# EAGLE design micro (EAGLE 9.6.2)
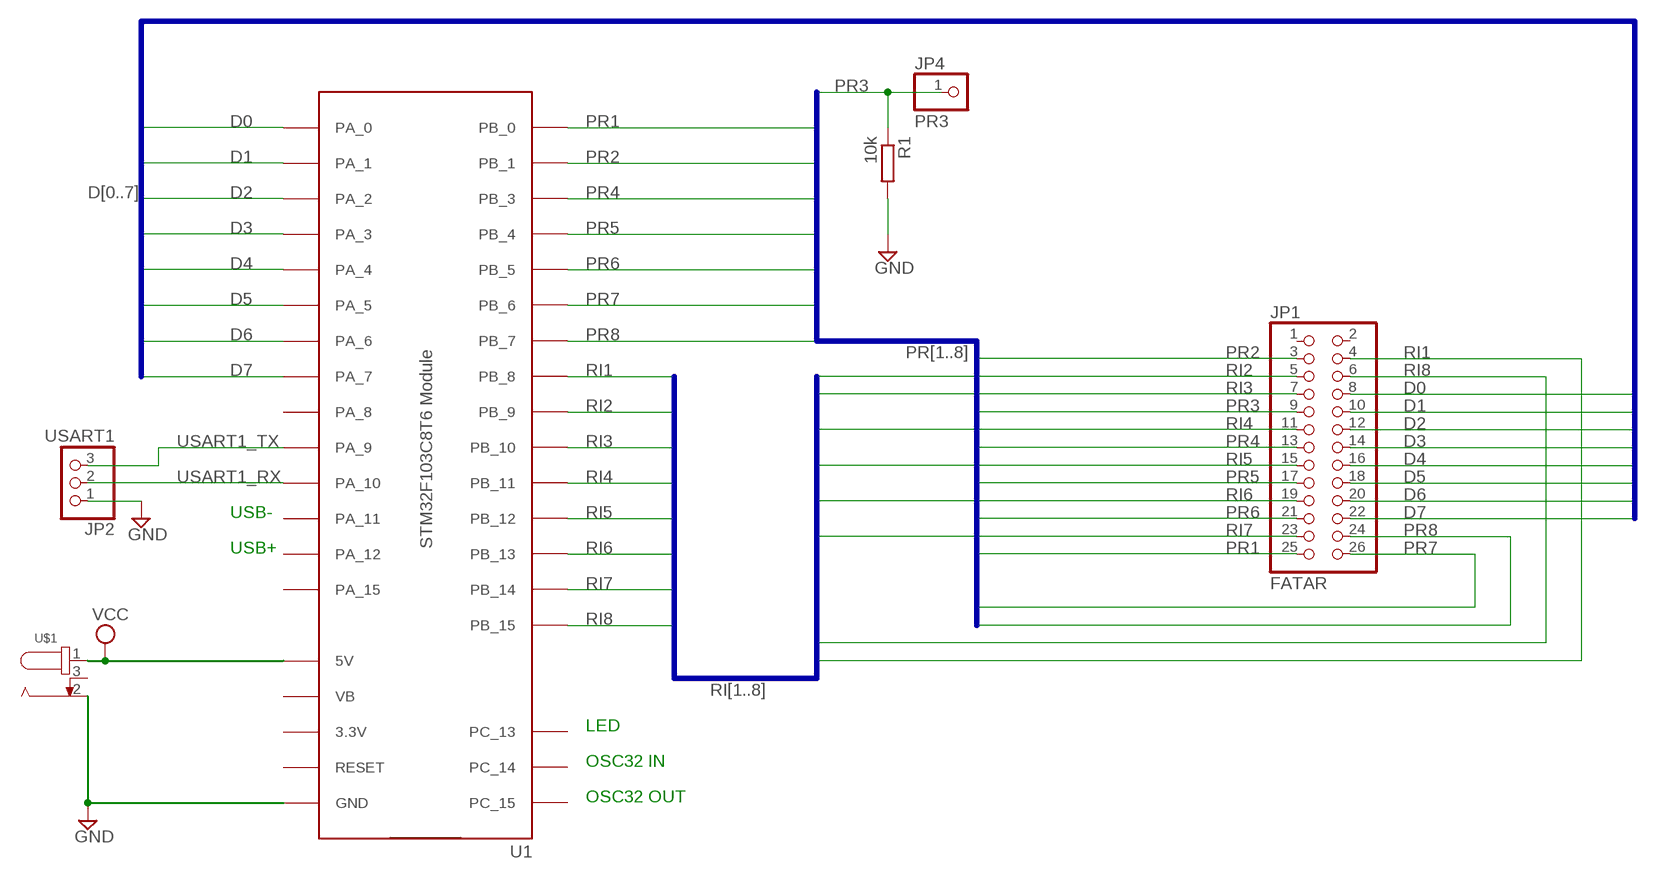
[diagram p0: schematic, sheet 1]

## Parts
JP1  FATAR  PINHD-2X13  [2X13]
JP2  USART1  PINHD-1X3  [1X03]
JP4  PR3  PINHD-1X1  [1X01]
R1  10k  R-EU_0204/7  [0204/7]
U1  STM32F103C8T6-MODULE  [STM32F103C8T6-MODULE]
U$1  694103303002  [694103303002]

## Nets
D0: JP1.8 U1.PA_0
D1: JP1.10 U1.PA_1
D2: JP1.12 U1.PA_2
D3: JP1.14 U1.PA_3
D4: JP1.16 U1.PA_4
D5: JP1.18 U1.PA_5
D6: JP1.20 U1.PA_6
D7: JP1.22 U1.PA_7
GND: JP2.1 R1.2 U1.GND@1(GND) U1.GND@2(GND) U1.GND@3(GND) U$1.2
PR1: JP1.25 U1.PB_0
PR2: JP1.3 U1.PB_1
PR3: JP1.9 JP4.1 R1.1
PR4: JP1.13 U1.PB_3
PR5: JP1.17 U1.PB_4
PR6: JP1.21 U1.PB_5
PR7: JP1.26 U1.PB_6
PR8: JP1.24 U1.PB_7
RI1: JP1.4 U1.PB_8
RI2: JP1.5 U1.PB_9
RI3: JP1.7 U1.PB_10
RI4: JP1.11 U1.PB_11
RI5: JP1.15 U1.PB_12
RI6: JP1.19 U1.PB_13
RI7: JP1.23 U1.PB_14
RI8: JP1.6 U1.PB_15
USART1_RX: JP2.2 U1.PA_10
USART1_TX: JP2.3 U1.PA_9
VCC: U1.5V U$1.1
Unconnected: JP1.1 JP1.2 U1.3.3V@1(3.3V) U1.3.3V@2(3.3V) U1.PA_8 U1.PA_11 U1.PA_12 U1.PA_15 U1.PC_13 U1.PC_14 U1.PC_15 U1.RESET U1.VB U$1.3

## Buses
D[0..7]
PR[1..8]
RI[1..8]

## Notes on the sheet
- USB-
- USB+
- LED
- OSC32 IN
- OSC32 OUT

## Library data of the parts
JP1 = pinhead:PINHD-2X13: PIN HEADER
JP2 = pinhead:PINHD-1X3: PIN HEADER
JP4 = pinhead:PINHD-1X1: PIN HEADER
R1 = rcl:R-EU_: RESISTOR, European symbol; SPICEPREFIX: R
U1 = bluepill_eagle_lib:STM32F103C8T6-MODULE: STM32F103C8T6 module with ARM Cortex-3, 20kB SRAM, 64kB Flash, 72MHz
U$1 = DC Power Jacks:694103303002: CONN PWR JACK 1.05X3.5MM SOLDER Manufacturer's datasheet <https://katalog.we-online.de/em/datasheet/6941xx303002.pdf>; CREATED_BY: PCBLayout.com; DIGIKEY_PART_NUMBER: 732-5925-ND; MANUFACTURER: Wurth Electronics Inc.; MPN: 694103303002

## Board
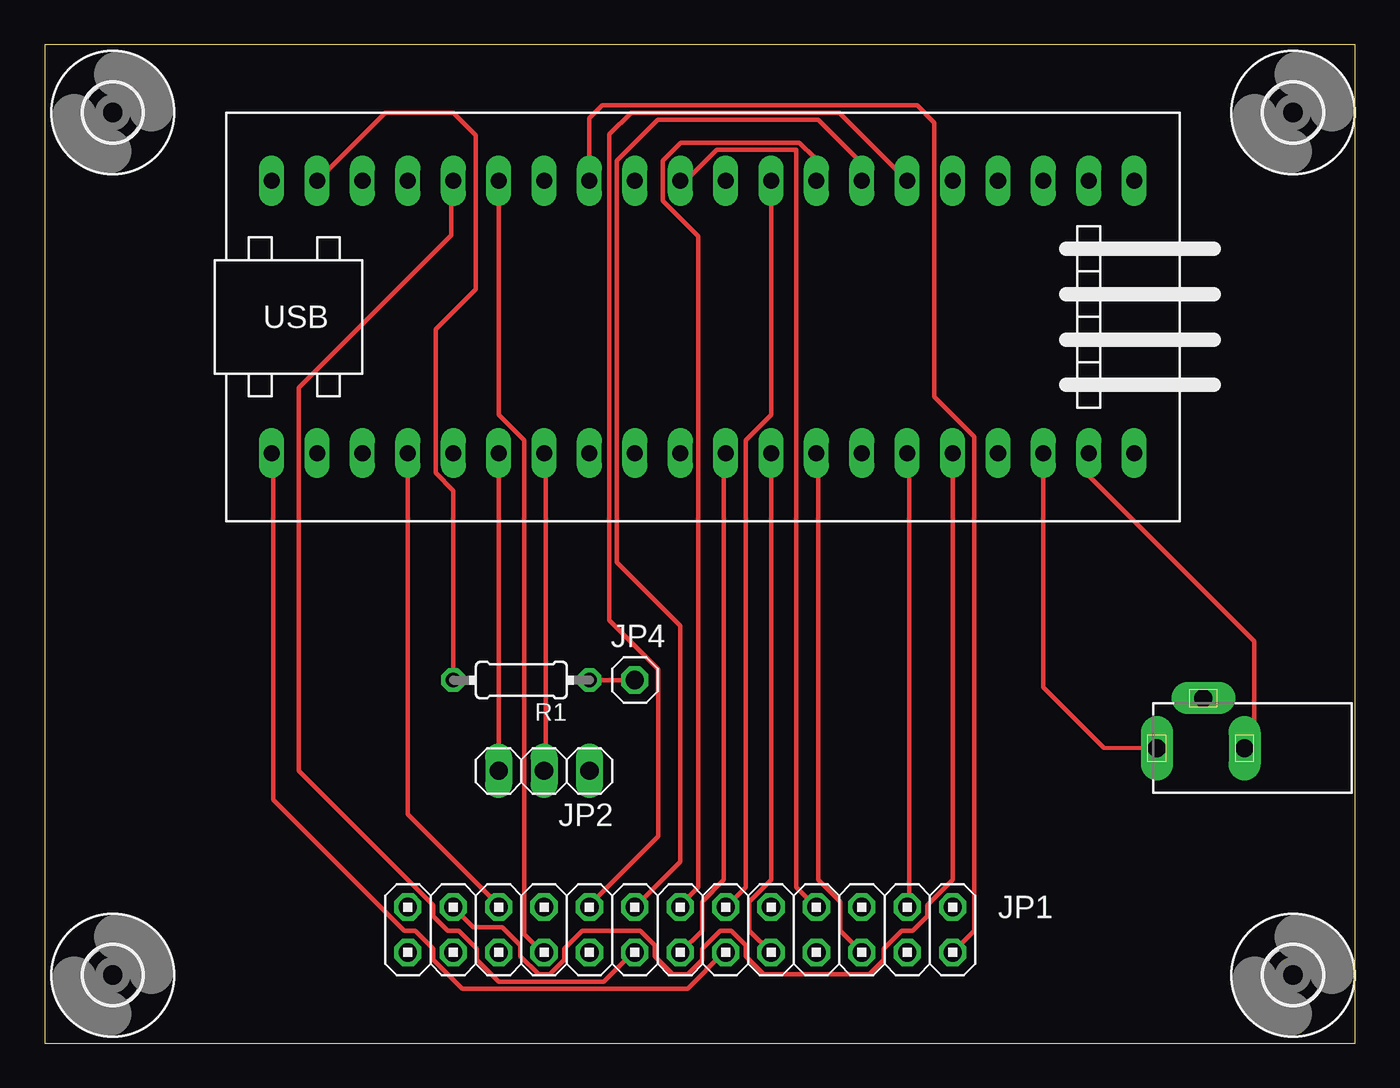
[diagram p1: board, top side]
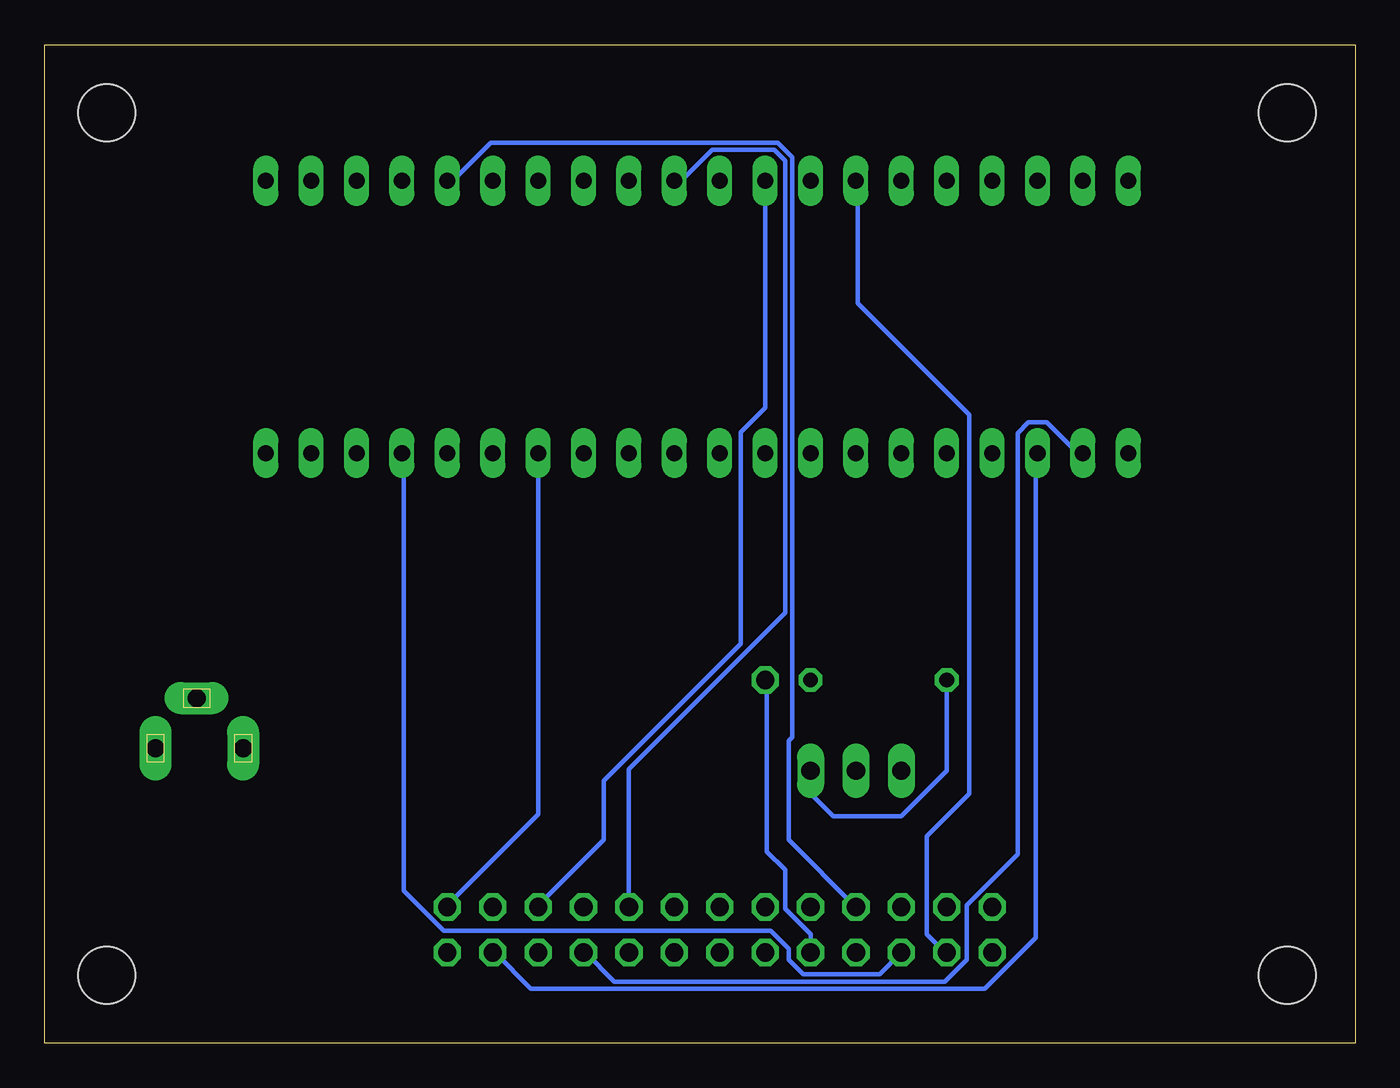
[diagram p2: board, bottom side, seen from below]

Size 73.33 x 55.87 mm. Coordinates in mm from the lower left corner, seen from the top.
Outline: 0,0 73.33,0 73.33,55.87 0,55.87 0,0
Copper layers (1*16): Top 0.035mm / dielectric 1.5mm / Bottom 0.035mm
Design rules "default *": minimum track width 10mil, minimum drill 0.35mm, track to track 6mil, track to pad 6mil, pad to pad 6mil, via to via 6mil, smd to smd 6mil, copper to edge 40mil, drill to drill 6mil, minimum pad ring 10mil, minimum via ring 8mil, stop-mask expansion 4mil, vias tented up to drill 0mil, thermal gap 10mil

### Footprints (pad centres in the part's own frame; a part is rotated, then mirrored left to right if it is on the bottom)
2X13 = drill 1.016 octagon: 1 -15.24,-1.27; 2 -15.24,1.27; 3 -12.7,-1.27; 4 -12.7,1.27; 5 -10.16,-1.27; 6 -10.16,1.27; 7 -7.62,-1.27; 8 -7.62,1.27; 9 -5.08,-1.27; 10 -5.08,1.27; 11 -2.54,-1.27; 12 -2.54,1.27; 13 0,-1.27; 14 0,1.27; 15 2.54,-1.27; 16 2.54,1.27; 17 5.08,-1.27; 18 5.08,1.27; 19 7.62,-1.27; 20 7.62,1.27; 21 10.16,-1.27; 22 10.16,1.27; 23 12.7,-1.27; 24 12.7,1.27; 25 15.24,-1.27; 26 15.24,1.27
1X03 = drill 1.016 long: 1 -2.54,0; 2 0,0; 3 2.54,0
1X01 = drill 1.016 octagon: 1 0,0
0204/7 = drill 0.813 octagon: 1 -3.81,0; 2 3.81,0
STM32F103C8T6-MODULE = drill 0.9 long: 3.3V@1 25.4,-7.62; 3.3V@2 -17.78,7.62; 5V 20.32,-7.62; GND@1 22.86,-7.62; GND@2 -20.32,7.62; GND@3 -22.86,7.62; PA_0 15.24,7.62; PA_1 12.7,7.62; PA_2 10.16,7.62; PA_3 7.62,7.62; PA_4 5.08,7.62; PA_5 2.54,7.62; PA_6 0,7.62; PA_7 -2.54,7.62; PA_8 -12.7,-7.62; PA_9 -10.16,-7.62; PA_10 -7.62,-7.62; PA_11 -5.08,-7.62; PA_12 -2.54,-7.62; PA_15 0,-7.62; PB_0 -5.08,7.62; PB_1 -7.62,7.62; PB_3 2.54,-7.62; PB_4 5.08,-7.62; PB_5 7.62,-7.62; PB_6 10.16,-7.62; PB_7 12.7,-7.62; PB_8 15.24,-7.62; PB_9 17.78,-7.62; PB_10 -10.16,7.62; PB_11 -12.7,7.62; PB_12 -22.86,-7.62; PB_13 -20.32,-7.62; PB_14 -17.78,-7.62; PB_15 -15.24,-7.62; PC_13 22.86,7.62; PC_14 20.32,7.62; PC_15 17.78,7.62; RESET -15.24,7.62; VB 25.4,7.62
694103303002 = drill 1 pad 1.8 long: 1 0,0; 2 -4.9,0; 3 -2.6,-2.8
3,2 = hole 3.2: 0,0

### Placement (x,y rotation side)
JP1  35.56,6.35 0 top
JP2  27.94,15.24 180 top
JP4  33.02,20.32 0 top
R1  26.67,20.32 180 top
U1  35.56,40.64 0 top
U$1  62.23,16.51 180 top
U$2  [3,2]  3.81,3.81 0 top
U$3  [3,2]  3.81,52.07 0 top
U$4  [3,2]  69.85,52.07 0 top
U$5  [3,2]  69.85,3.81 0 top

### Tracks (layer width: path | path; a pad name or v marks a point on that pad's centre or on a via)
D0
  Bottom 0.254: JP1.8 31.7,11.38 31.7,16.92 31.5,17.12 31.5,49.58 32.31,50.39 48.36,50.39 50.39,48.36 50.8,48.36 U1.PA_0
D1
  Top 0.254: U1.PA_1 44.45,52.07 32.82,52.07 31.6,50.85 31.6,23.67 34.34,20.93 34.34,11.58 30.48,7.72 JP1.10
D2
  Top 0.254: U1.PA_2 45.72,49.23 43.28,51.66 34.29,51.66 32,49.38 32,26.92 35.56,23.37 35.56,10.16 JP1.12
D3
  Top 0.254: JP1.14 35.56,7.72 36.58,8.74 36.58,45.15 34.58,47.15 34.58,49.37 35.6,50.39 42.23,50.39 43.09,49.53 43.18,49.53 U1.PA_3
D4
  Top 0.254: U1.PA_4 40.64,35.15 39.22,33.73 39.22,8.74 JP1.16
D5
  Bottom 0.254: JP1.18 40.64,15.34 31.9,24.08 31.9,49.38 32.51,49.99 35.97,49.99 37.59,48.36 38,48.36 U1.PA_5
D6
  Top 0.254: JP1.20 42.06,8.74 42.06,49.99 37.59,49.99 35.97,48.36 35.56,48.36 U1.PA_6
D7
  Bottom 0.254: U1.PA_7 33.02,35.56 34.39,34.19 34.39,22.35 42.06,14.68 42.06,11.38 45.72,7.72 JP1.22
GND
  Top 0.254: U$1.2 67.67,17.05 67.67,22.5 58.42,31.75 U1.GND@1 | R1.2 22.86,30.93 21.88,31.91 21.88,39.95 24.13,42.2 24.13,50.8 22.86,52.07 19.05,52.07 U1.GND@2
  Bottom 0.254: R1.2 22.86,15.24 25.4,12.7 29.21,12.7 30.48,13.97 JP2.1
PR1
  Top 0.254: U1.PB_0 30.48,51.77 31.19,52.48 48.82,52.48 49.78,51.51 49.78,36.17 52.02,33.93 52.02,6.3 JP1.25
PR2
  Bottom 0.254: U1.PB_1 27.84,48.16 27.84,41.4 21.59,35.15 21.59,13.97 23.98,11.58 23.98,6.1 22.96,5.08 JP1.3
PR3
  Top 0.254: R1.1 JP4.1
  Bottom 0.254: JP1.9 30.48,6.1 31.9,7.52 31.9,9.7 32.92,10.72 32.92,20.22 JP4.1
PR4
  Top 0.254: JP1.13 36.78,6.3 36.78,7.92 38,9.14 38,32.92 U1.PB_3
PR5
  Top 0.254: U1.PB_4 40.64,9.14 39.42,7.92 39.42,6.3 JP1.17
PR6
  Top 0.254: JP1.21 44.5,6.3 44.5,7.92 43.28,9.14 43.28,32.92 U1.PB_5
PR7
  Bottom 0.254: U1.PB_6 45.72,12.8 50.8,7.72 JP1.26
PR8
  Top 0.254: U1.PB_7 48.36,32.92 48.36,7.72 JP1.24
RI1
  Top 0.254: U1.PB_8 50.8,9.14 49.38,7.72 49.38,7.11 48.56,6.3 47.95,6.3 46.94,5.28 46.94,4.67 46.13,3.86 40.23,3.86 39.22,4.88 39.22,5.49 38.41,6.3 37.8,6.3 36.78,5.28 36.78,4.67 35.97,3.86 35.15,3.86 34.14,4.88 34.14,5.49 33.33,6.3 30.07,6.3 29.06,5.28 29.06,4.67 28.25,3.86 27.64,3.86 26.62,4.88 26.62,5.49 25.6,6.5 23.98,6.5 JP1.4
RI2
  Bottom 0.254: JP1.5 26.62,3.86 30.89,3.86 31.7,4.67 31.7,5.28 32.72,6.3 51,6.3 53.24,8.53 53.24,32.92 U1.PB_9
RI3
  Top 0.254: U1.PB_10 25.4,35.15 26.82,33.73 26.82,6.1 27.84,5.08 JP1.7
RI4
  Top 0.254: U1.PB_11 22.76,48.16 22.76,45.21 14.22,36.68 14.22,15.24 21.74,7.72 21.74,7.11 22.55,6.3 23.16,6.3 24.18,5.28 24.18,4.67 25.4,3.45 31.29,3.45 32.92,5.08 JP1.11
RI5
  Top 0.254: U1.PB_12 12.8,32.92 12.8,13.61 20.12,6.3 20.73,6.3 21.74,5.28 21.74,4.67 23.37,3.05 35.97,3.05 38,5.08 JP1.15
RI6
  Bottom 0.254: U1.PB_13 15.24,33.12 15.65,33.12 17.27,34.75 18.29,34.75 18.9,34.14 18.9,10.57 21.74,7.72 21.74,4.67 22.96,3.45 41.45,3.45 43.08,5.08 JP1.19
RI7
  Bottom 0.254: U1.PB_14 17.88,32.92 17.88,5.89 20.73,3.05 46.13,3.05 48.16,5.08 JP1.23
RI8
  Top 0.254: U1.PB_15 20.32,12.8 25.4,7.72 JP1.6
USART1_RX
  Top 0.254: U1.PA_10 28.04,32.92 28.04,15.24 JP2.2
USART1_TX
  Top 0.254: JP2.3 U1.PA_9
VCC
  Top 0.254: U1.5V 55.88,19.91 59.27,16.53 U$1.1